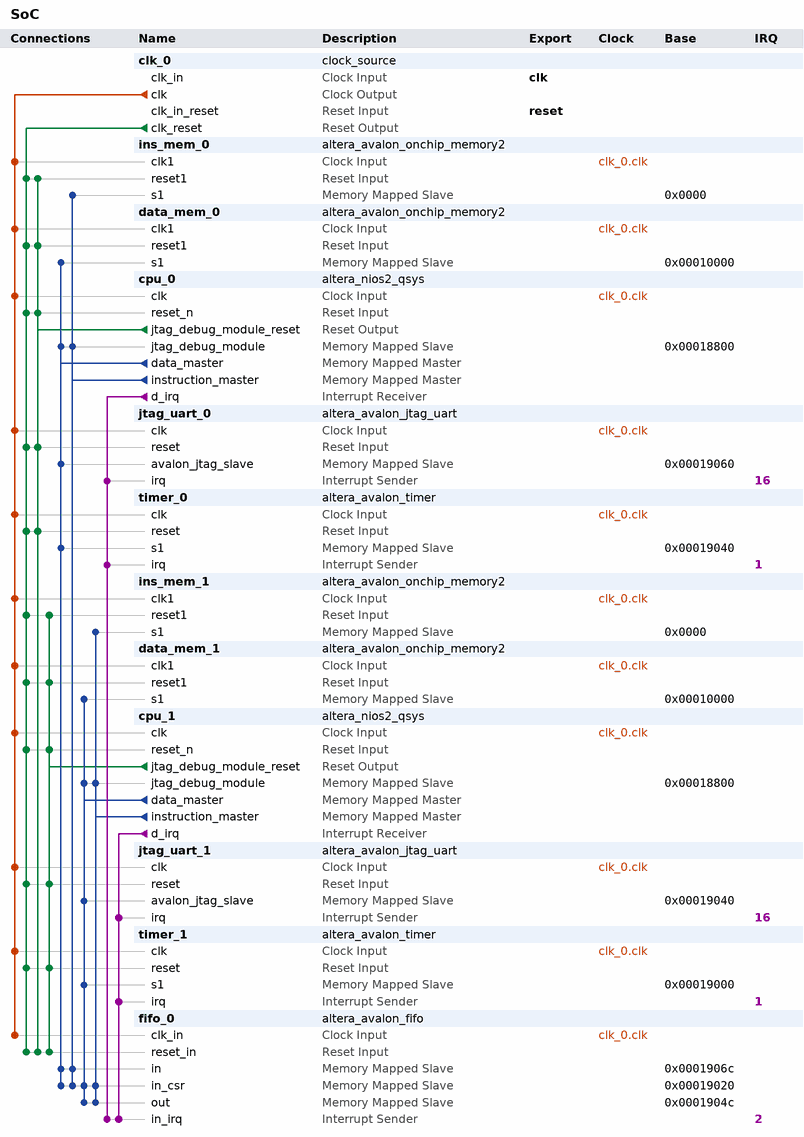
[diagram p0: system contents]
# Platform Designer (Qsys) system SoC, Cyclone IV E EP4CE115F29C7
# Parameters at their usual value, and those the tool derives, are not listed.
package require -exact qsys 13.1
create_system SoC
set_project_property DEVICE_FAMILY {Cyclone IV E}
set_project_property DEVICE EP4CE115F29C7

add_instance clk_0 clock_source 13.1
set_instance_parameter_value clk_0 clockFrequency 50000000

add_instance ins_mem_0 altera_avalon_onchip_memory2 13.1
set_instance_parameter_value ins_mem_0 dataWidth 32
set_instance_parameter_value ins_mem_0 dualPort false
set_instance_parameter_value ins_mem_0 initMemContent true
set_instance_parameter_value ins_mem_0 initializationFileName ins_mem_0
set_instance_parameter_value ins_mem_0 memorySize 65536

add_instance data_mem_0 altera_avalon_onchip_memory2 13.1
set_instance_parameter_value data_mem_0 dataWidth 32
set_instance_parameter_value data_mem_0 dualPort false
set_instance_parameter_value data_mem_0 initMemContent true
set_instance_parameter_value data_mem_0 initializationFileName data_mem_0
set_instance_parameter_value data_mem_0 memorySize 32768

add_instance cpu_0 altera_nios2_qsys 13.1
set_instance_parameter_value cpu_0 resetSlave ins_mem_0.s1
set_instance_parameter_value cpu_0 exceptionSlave ins_mem_0.s1
set_instance_parameter_value cpu_0 breakSlave cpu_0.jtag_debug_module
set_instance_parameter_value cpu_0 muldiv_multiplierType NoneSmall
set_instance_parameter_value cpu_0 impl Tiny
set_instance_parameter_value cpu_0 icache_size 4096

add_instance jtag_uart_0 altera_avalon_jtag_uart 13.1
set_instance_parameter_value jtag_uart_0 simInteractiveOptions INTERACTIVE_ASCII_OUTPUT

add_instance timer_0 altera_avalon_timer 13.1
set_instance_parameter_value timer_0 period 1
set_instance_parameter_value timer_0 periodUnits MSEC

add_instance ins_mem_1 altera_avalon_onchip_memory2 13.1
set_instance_parameter_value ins_mem_1 dataWidth 32
set_instance_parameter_value ins_mem_1 dualPort false
set_instance_parameter_value ins_mem_1 initMemContent true
set_instance_parameter_value ins_mem_1 initializationFileName ins_mem_1
set_instance_parameter_value ins_mem_1 memorySize 65536

add_instance data_mem_1 altera_avalon_onchip_memory2 13.1
set_instance_parameter_value data_mem_1 dataWidth 32
set_instance_parameter_value data_mem_1 dualPort false
set_instance_parameter_value data_mem_1 initMemContent true
set_instance_parameter_value data_mem_1 initializationFileName data_mem_1
set_instance_parameter_value data_mem_1 memorySize 32768

add_instance cpu_1 altera_nios2_qsys 13.1
set_instance_parameter_value cpu_1 resetSlave ins_mem_1.s1
set_instance_parameter_value cpu_1 exceptionSlave ins_mem_1.s1
set_instance_parameter_value cpu_1 breakSlave cpu_1.jtag_debug_module
set_instance_parameter_value cpu_1 muldiv_multiplierType NoneSmall
set_instance_parameter_value cpu_1 impl Tiny
set_instance_parameter_value cpu_1 icache_size 4096

add_instance jtag_uart_1 altera_avalon_jtag_uart 13.1
set_instance_parameter_value jtag_uart_1 simInteractiveOptions INTERACTIVE_ASCII_OUTPUT

add_instance timer_1 altera_avalon_timer 13.1
set_instance_parameter_value timer_1 period 1
set_instance_parameter_value timer_1 periodUnits MSEC

add_instance fifo_0 altera_avalon_fifo 13.1
set_instance_parameter_value fifo_0 bitsPerSymbol 16
set_instance_parameter_value fifo_0 channelWidth 8
set_instance_parameter_value fifo_0 errorWidth 8
set_instance_parameter_value fifo_0 fifoDepth 16
set_instance_parameter_value fifo_0 fifoInputInterfaceOptions AVALONMM_WRITE
set_instance_parameter_value fifo_0 fifoOutputInterfaceOptions AVALONMM_READ
set_instance_parameter_value fifo_0 singleClockMode true
set_instance_parameter_value fifo_0 symbolsPerBeat 2
set_instance_parameter_value fifo_0 useIRQ true
set_instance_parameter_value fifo_0 usePacket true
set_instance_parameter_value fifo_0 useReadControl false

# connections
add_connection clk_0.clk cpu_0.clk clock
add_connection clk_0.clk cpu_1.clk clock
add_connection clk_0.clk data_mem_0.clk1 clock
add_connection clk_0.clk data_mem_1.clk1 clock
add_connection clk_0.clk fifo_0.clk_in clock
add_connection clk_0.clk ins_mem_0.clk1 clock
add_connection clk_0.clk ins_mem_1.clk1 clock
add_connection clk_0.clk jtag_uart_0.clk clock
add_connection clk_0.clk jtag_uart_1.clk clock
add_connection clk_0.clk timer_0.clk clock
add_connection clk_0.clk timer_1.clk clock
add_connection clk_0.clk_reset cpu_0.reset_n reset
add_connection clk_0.clk_reset cpu_1.reset_n reset
add_connection clk_0.clk_reset data_mem_0.reset1 reset
add_connection clk_0.clk_reset data_mem_1.reset1 reset
add_connection clk_0.clk_reset fifo_0.reset_in reset
add_connection clk_0.clk_reset ins_mem_0.reset1 reset
add_connection clk_0.clk_reset ins_mem_1.reset1 reset
add_connection clk_0.clk_reset jtag_uart_0.reset reset
add_connection clk_0.clk_reset jtag_uart_1.reset reset
add_connection clk_0.clk_reset timer_0.reset reset
add_connection clk_0.clk_reset timer_1.reset reset
add_connection cpu_0.jtag_debug_module_reset cpu_0.reset_n reset
add_connection cpu_0.jtag_debug_module_reset data_mem_0.reset1 reset
add_connection cpu_0.jtag_debug_module_reset fifo_0.reset_in reset
add_connection cpu_0.jtag_debug_module_reset ins_mem_0.reset1 reset
add_connection cpu_0.jtag_debug_module_reset jtag_uart_0.reset reset
add_connection cpu_0.jtag_debug_module_reset timer_0.reset reset
add_connection cpu_1.jtag_debug_module_reset cpu_1.reset_n reset
add_connection cpu_1.jtag_debug_module_reset data_mem_1.reset1 reset
add_connection cpu_1.jtag_debug_module_reset fifo_0.reset_in reset
add_connection cpu_1.jtag_debug_module_reset ins_mem_1.reset1 reset
add_connection cpu_1.jtag_debug_module_reset jtag_uart_1.reset reset
add_connection cpu_1.jtag_debug_module_reset timer_1.reset reset
add_connection cpu_0.data_master cpu_0.jtag_debug_module avalon
set_connection_parameter_value cpu_0.data_master/cpu_0.jtag_debug_module baseAddress 0x00018800
add_connection cpu_0.data_master data_mem_0.s1 avalon
set_connection_parameter_value cpu_0.data_master/data_mem_0.s1 baseAddress 0x00010000
add_connection cpu_0.data_master fifo_0.in avalon
set_connection_parameter_value cpu_0.data_master/fifo_0.in baseAddress 0x0001906c
add_connection cpu_0.data_master fifo_0.in_csr avalon
set_connection_parameter_value cpu_0.data_master/fifo_0.in_csr baseAddress 0x00019020
add_connection cpu_0.data_master jtag_uart_0.avalon_jtag_slave avalon
set_connection_parameter_value cpu_0.data_master/jtag_uart_0.avalon_jtag_slave baseAddress 0x00019060
add_connection cpu_0.data_master timer_0.s1 avalon
set_connection_parameter_value cpu_0.data_master/timer_0.s1 baseAddress 0x00019040
add_connection cpu_0.instruction_master cpu_0.jtag_debug_module avalon
set_connection_parameter_value cpu_0.instruction_master/cpu_0.jtag_debug_module baseAddress 0x00018800
add_connection cpu_0.instruction_master fifo_0.in avalon
set_connection_parameter_value cpu_0.instruction_master/fifo_0.in baseAddress 0x0001906c
add_connection cpu_0.instruction_master fifo_0.in_csr avalon
set_connection_parameter_value cpu_0.instruction_master/fifo_0.in_csr baseAddress 0x00019020
add_connection cpu_0.instruction_master ins_mem_0.s1 avalon
set_connection_parameter_value cpu_0.instruction_master/ins_mem_0.s1 baseAddress 0x0000
add_connection cpu_1.data_master cpu_1.jtag_debug_module avalon
set_connection_parameter_value cpu_1.data_master/cpu_1.jtag_debug_module baseAddress 0x00018800
add_connection cpu_1.data_master data_mem_1.s1 avalon
set_connection_parameter_value cpu_1.data_master/data_mem_1.s1 baseAddress 0x00010000
add_connection cpu_1.data_master fifo_0.in_csr avalon
set_connection_parameter_value cpu_1.data_master/fifo_0.in_csr baseAddress 0x00019020
add_connection cpu_1.data_master fifo_0.out avalon
set_connection_parameter_value cpu_1.data_master/fifo_0.out baseAddress 0x0001904c
add_connection cpu_1.data_master jtag_uart_1.avalon_jtag_slave avalon
set_connection_parameter_value cpu_1.data_master/jtag_uart_1.avalon_jtag_slave baseAddress 0x00019040
add_connection cpu_1.data_master timer_1.s1 avalon
set_connection_parameter_value cpu_1.data_master/timer_1.s1 baseAddress 0x00019000
add_connection cpu_1.instruction_master cpu_1.jtag_debug_module avalon
set_connection_parameter_value cpu_1.instruction_master/cpu_1.jtag_debug_module baseAddress 0x00018800
add_connection cpu_1.instruction_master fifo_0.in_csr avalon
set_connection_parameter_value cpu_1.instruction_master/fifo_0.in_csr baseAddress 0x00019020
add_connection cpu_1.instruction_master fifo_0.out avalon
set_connection_parameter_value cpu_1.instruction_master/fifo_0.out baseAddress 0x0001904c
add_connection cpu_1.instruction_master ins_mem_1.s1 avalon
set_connection_parameter_value cpu_1.instruction_master/ins_mem_1.s1 baseAddress 0x0000
add_connection cpu_0.d_irq fifo_0.in_irq interrupt
set_connection_parameter_value cpu_0.d_irq/fifo_0.in_irq irqNumber 2
add_connection cpu_0.d_irq jtag_uart_0.irq interrupt
set_connection_parameter_value cpu_0.d_irq/jtag_uart_0.irq irqNumber 16
add_connection cpu_0.d_irq timer_0.irq interrupt
set_connection_parameter_value cpu_0.d_irq/timer_0.irq irqNumber 1
add_connection cpu_1.d_irq fifo_0.in_irq interrupt
set_connection_parameter_value cpu_1.d_irq/fifo_0.in_irq irqNumber 2
add_connection cpu_1.d_irq jtag_uart_1.irq interrupt
set_connection_parameter_value cpu_1.d_irq/jtag_uart_1.irq irqNumber 16
add_connection cpu_1.d_irq timer_1.irq interrupt
set_connection_parameter_value cpu_1.d_irq/timer_1.irq irqNumber 1

# exported interfaces
add_interface clk clock sink
set_interface_property clk EXPORT_OF clk_0.clk_in
add_interface reset reset sink
set_interface_property reset EXPORT_OF clk_0.clk_in_reset

set_interconnect_requirement {$system} qsys_mm.clockCrossingAdapter HANDSHAKE
set_interconnect_requirement {$system} qsys_mm.maxAdditionalLatency 1

save_system SoC.qsys
